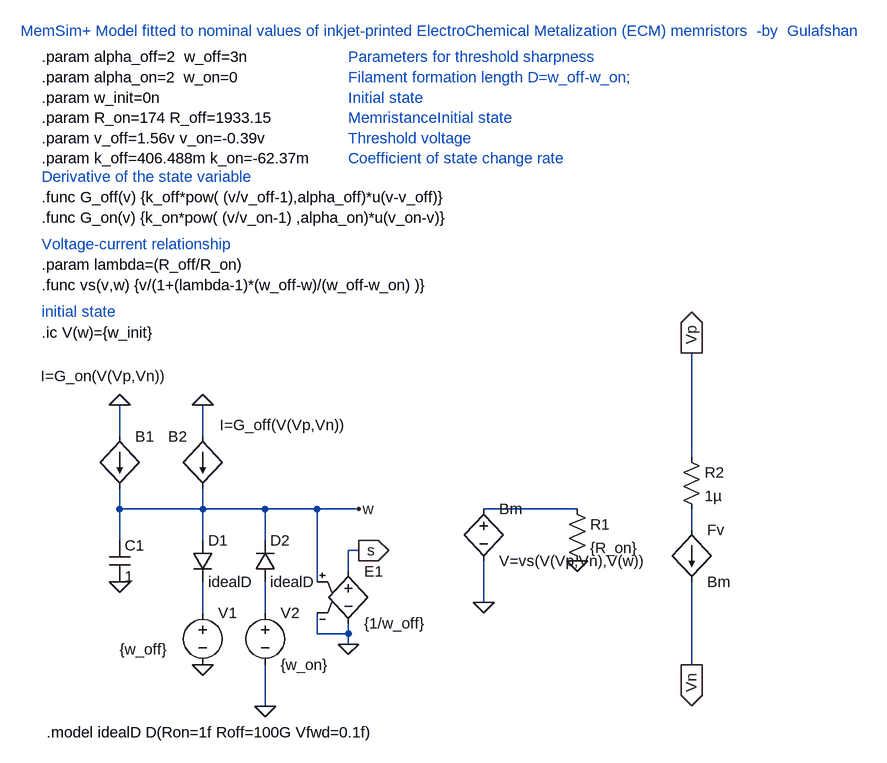
[diagram p0: schematic MemSim+ECM_Nominal.asc]
MemSim+ECM_Nominal.asc, the LTspice schematic file:
Version 4
SHEET 1 3964 1792
WIRE 160 400 160 352
WIRE 288 400 288 352
WIRE 1040 432 1040 272
WIRE 160 512 160 480
WIRE 288 512 288 480
WIRE 288 512 160 512
WIRE 384 512 288 512
WIRE 464 512 384 512
WIRE 528 512 464 512
WIRE 864 512 720 512
WIRE 1040 544 1040 512
WIRE 160 560 160 512
WIRE 288 560 288 512
WIRE 384 560 384 512
WIRE 528 576 512 576
WIRE 512 608 512 576
WIRE 464 624 464 512
WIRE 720 656 720 592
WIRE 288 672 288 624
WIRE 384 672 384 624
WIRE 464 704 464 672
WIRE 512 704 512 688
WIRE 512 704 464 704
WIRE 512 720 512 704
WIRE 1040 752 1040 624
WIRE 384 816 384 752
FLAG 160 352 0
FLAG 288 352 0
FLAG 160 624 0
FLAG 288 752 0
FLAG 528 512 w
FLAG 720 656 0
FLAG 864 592 0
FLAG 512 720 0
FLAG 528 576 s
IOPIN 528 576 Out
FLAG 1040 272 Vp
IOPIN 1040 272 Out
FLAG 1040 752 Vn
IOPIN 1040 752 Out
FLAG 384 816 0
SYMBOL bi 160 400 R0
WINDOW 3 -121 -93 Left 2
SYMATTR Value I=G_on(V(Vp,Vn))
SYMATTR InstName B1
SYMBOL bi 288 400 M0
WINDOW 3 -220 -17 Left 2
SYMATTR Value I=G_off(V(Vp,Vn))
SYMATTR InstName B2
SYMBOL cap 144 560 R0
SYMATTR InstName C1
SYMATTR Value 1
SYMBOL diode 272 560 R0
SYMATTR InstName D1
SYMATTR Value idealD
SYMBOL diode 368 624 M180
WINDOW 0 24 64 Left 2
WINDOW 3 24 0 Left 2
SYMATTR InstName D2
SYMATTR Value idealD
SYMBOL voltage 288 656 R0
WINDOW 123 0 0 Left 2
WINDOW 39 0 0 Left 2
WINDOW 3 -128 72 Left 2
SYMATTR Value {w_off}
SYMATTR InstName V1
SYMBOL res 848 496 R0
SYMATTR InstName R1
SYMATTR Value {R_on}
SYMBOL f 1040 544 R0
SYMATTR InstName Fv
SYMATTR Value Bm
SYMATTR Value2 -1
SYMBOL bv 720 496 R0
SYMATTR InstName Bm
SYMATTR Value V=vs(V(Vp,Vn),V(w))
SYMBOL e 512 592 R0
SYMATTR InstName E1
SYMATTR Value {1/w_off}
SYMBOL res 1024 416 R0
SYMATTR InstName R2
SYMATTR Value 1µ
SYMBOL voltage 384 656 R0
WINDOW 123 0 0 Left 0
WINDOW 39 0 0 Left 0
SYMATTR InstName V2
SYMATTR Value {w_on}
TEXT 8 -224 Left 2 ;MemSim+ Model fitted to nominal values of inkjet-printed ElectroChemical Metalization (ECM) memristors  -by  Gulafshan
TEXT 40 240 Left 2 !.ic V(w)={w_init}
TEXT 40 0 Left 2 ;Derivative of the state variable
TEXT 40 104 Left 2 ;Voltage-current relationship
TEXT 40 208 Left 2 ;initial state
TEXT 48 856 Left 2 !.model idealD D(Ron=1f Roff=100G Vfwd=0.1f)
TEXT 40 -184 Left 2 !.param alpha_off=2  w_off=3n\n.param alpha_on=2  w_on=0\n.param w_init=0n\n.param R_on=174 R_off=1933.15\n.param v_off=1.56v v_on=-0.39v\n.param k_off=406.488m k_on=-62.37m
TEXT 40 32 Left 2 !.func G_off(v) {k_off*pow( (v/v_off-1),alpha_off)*u(v-v_off)}\n.func G_on(v) {k_on*pow( (v/v_on-1) ,alpha_on)*u(v_on-v)}
TEXT 40 136 Left 2 !.param lambda=(R_off/R_on)\n.func vs(v,w) {v/(1+(lambda-1)*(w_off-w)/(w_off-w_on) )}
TEXT 512 -184 Left 2 ;Parameters for threshold sharpness\nFilament formation length D=w_off-w_on;\nInitial state \nMemristanceInitial state\nThreshold voltage\nCoefficient of state change rate

The netlist it stands for:
* MemSim+ECM_Nominal.asc
B1 0 w I=G_on(V(Vp,Vn))
B2 0 w I=G_off(V(Vp,Vn))
C1 w 0 1
D1 w N003 idealD
D2 N004 w idealD
V1 N003 0 {w_off}
R1 N001 0 {R_on}
Fv N002 Vn Bm -1
Bm N001 0 V=vs(V(Vp,Vn),V(w))
E1 s 0 w 0 {1/w_off}
R2 Vp N002 1µ
V2 N004 0 {w_on}
.model D D
.lib standard.dio
* MemSim+ Model fitted to nominal values of inkjet-printed ElectroChemical Metalization (ECM) memristors  -by  Gulafshan
.ic V(w)={w_init}
* Derivative of the state variable
* Voltage-current relationship
* initial state
.model idealD D(Ron=1f Roff=100G Vfwd=0.1f)
.param alpha_off=2  w_off=3n
.param alpha_on=2  w_on=0
.param w_init=0n
.param R_on=174 R_off=1933.15
.param v_off=1.56v v_on=-0.39v
.param k_off=406.488m k_on=-62.37m
.func G_off(v) {k_off*pow( (v/v_off-1),alpha_off)*u(v-v_off)}
.func G_on(v) {k_on*pow( (v/v_on-1) ,alpha_on)*u(v_on-v)}
.param lambda=(R_off/R_on)
.func vs(v,w) {v/(1+(lambda-1)*(w_off-w)/(w_off-w_on) )}
* Parameters for threshold sharpness
* Filament formation length D=w_off-w_on;
* Initial state
* MemristanceInitial state
* Threshold voltage
* Coefficient of state change rate
.backanno
.end